# EasyEDA schematic Sheet_1.json
TITLE: Sheet_1; REV: 1.0; Date: 2022-05-22; Sheet: 1/1; Drawn By: Valdez Cruz Marco Antonio; Company: Your Company
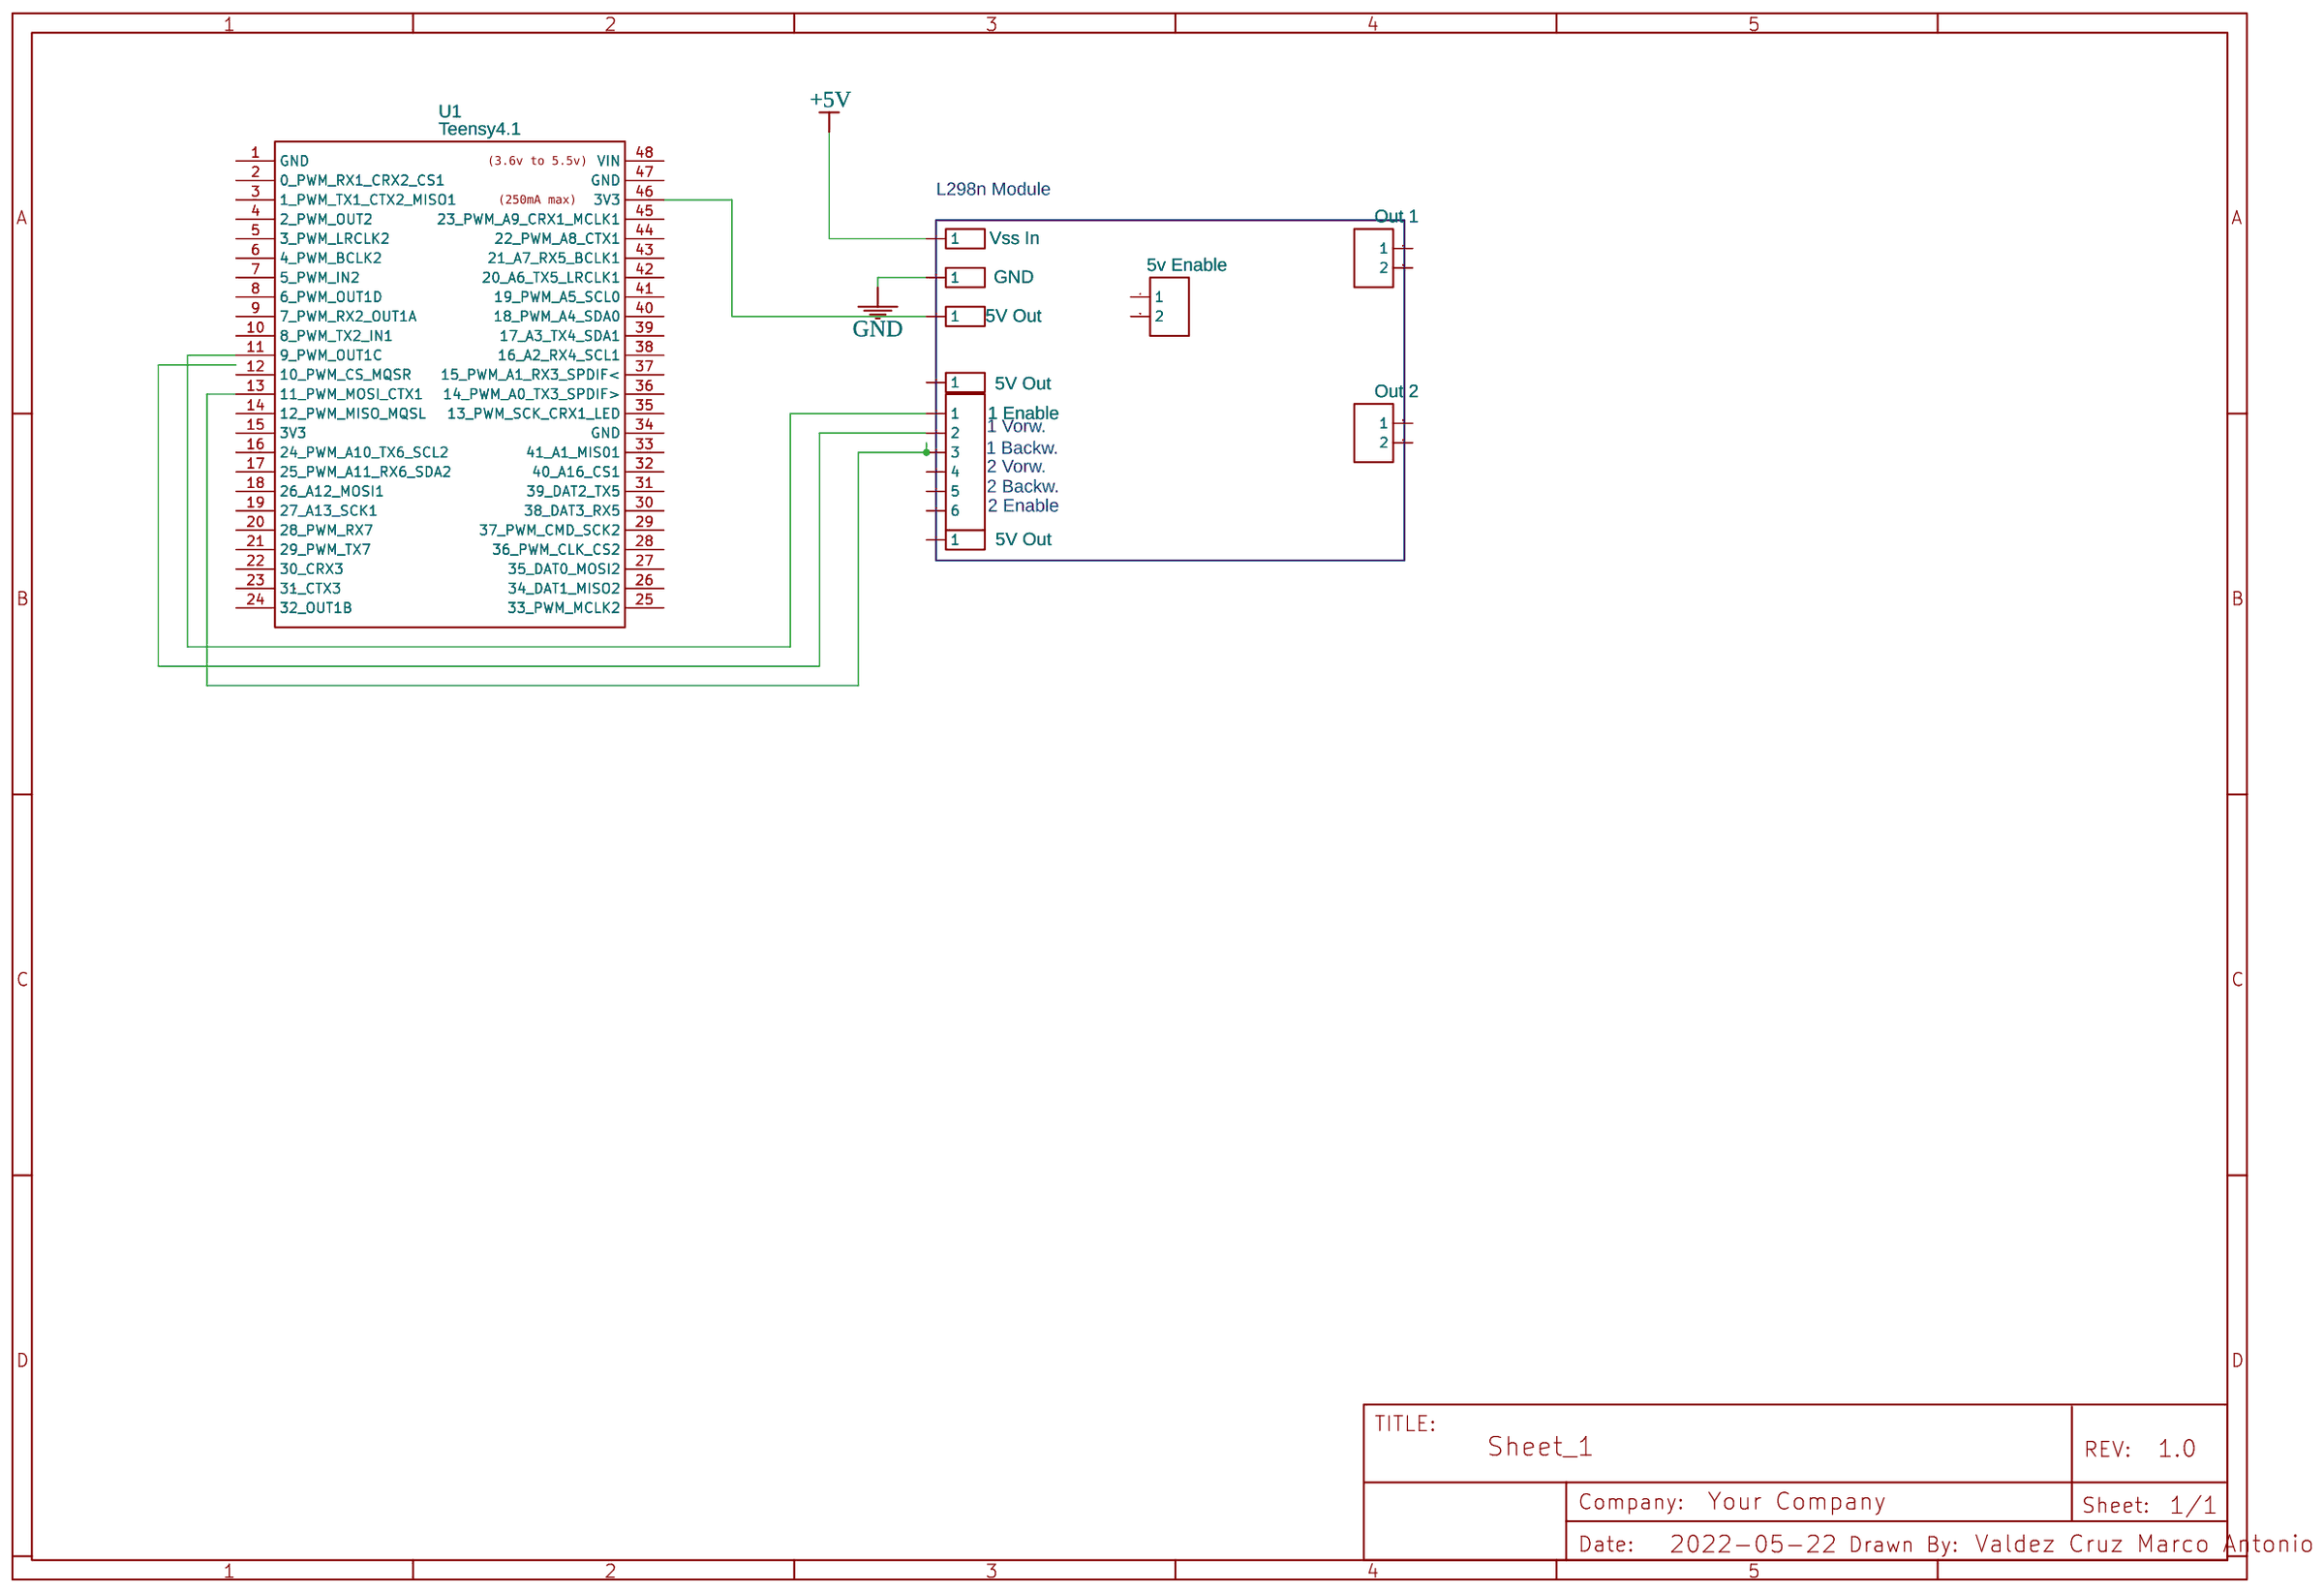
[diagram p0: schematic sheet]

## Parts
AAAAAP1  Out 1  [HDR-TH_2P-P2.54-V-M]
AAAAAP2  Out 2  [HDR-TH_2P-P2.54-V-M]
AAAAAP3  Vss In  [HDR-1X1/2.54]
AAAAAP4  GND  [HDR-1X1/2.54]
AAAAAP5  5V Out  [HDR-1X1/2.54]
AAAAAP6  5v Enable  [HDR-TH_2P-P2.54-V-M]
AAAAAP7  1 Enable  [HDR-6X1/2.54]
AAAAAP8  5V Out  [HDR-1X1/2.54]
AAAAAP9  5V Out  [HDR-1X1/2.54]
U1  Teensy4.1  [TEENSY4.1]

## Library data of the parts
AAAAAP1 AAAAAP2 AAAAAP6 = Header-Female-2.54_1x2: Supplier: LCSC; Manufacturer: BOOMELE; Manufacturer Part: 2.54-1*2PFemale; image: //image.lceda.cn/szlcsc/C49661.jpg; Supplier Part: C49661
AAAAAP3-AAAAAP5 AAAAAP8 AAAAAP9 = Header-Male-2.54_1x1: Supplier: LCSC; Manufacturer: ReliaPro; Supplier Part: C81276
AAAAAP7 = Header-Female-2.54_1x6: Supplier: LCSC; Manufacturer: BOOMELE; Manufacturer Part: Female header 1*6p; Supplier Part: C40877
U1 = Teensy4.1: Manufacturer: PJRC; link: https://www.pjrc.com/store/teensy41.html; Contributor: MaxBearMc

## Nets
+5V: AAAAAP3.1
GND: AAAAAP4.1
Net-(AAAAAP5-1): AAAAAP5.1 U1.46(3V3)
Net-(AAAAAP7-1): AAAAAP7.1 U1.11(9_PWM_OUT1C)
Net-(AAAAAP7-3): AAAAAP7.3 U1.13(11_PWM_MOSI_CTX1)

Not connected (* = marked no-connect by the designer): AAAAAP1 1 2; AAAAAP2 1 2; AAAAAP6 1 2; AAAAAP7 2 4 5 6; AAAAAP8 1; AAAAAP9 1; U1 1(GND) 2(0_PWM_RX1_CRX2_CS1) 3(1_PWM_TX1_CTX2_MISO1) 4(2_PWM_OUT2) 5(3_PWM_LRCLK2) 6(4_PWM_BCLK2) 7(5_PWM_IN2) 8(6_PWM_OUT1D) 9(7_PWM_RX2_OUT1A) 10(8_PWM_TX2_IN1) 12(10_PWM_CS_MQSR) 14(12_PWM_MISO_MQSL) 15(3V3) 16(24_PWM_A10_TX6_SCL2) 17(25_PWM_A11_RX6_SDA2) 18(26_A12_MOSI1) 19(27_A13_SCK1) 20(28_PWM_RX7) 21(29_PWM_TX7) 22(30_CRX3) 23(31_CTX3) 24(32_OUT1B) 25(33_PWM_MCLK2) 26(34_DAT1_MISO2) 27(35_DAT0_MOSI2) 28(36_PWM_CLK_CS2) 29(37_PWM_CMD_SCK2) 30(38_DAT3_RX5) 31(39_DAT2_TX5) 32(40_A16_CS1) 33(41_A1_MIS01) 34(GND) 35(13_PWM_SCK_CRX1_LED) 36(14_PWM_A0_TX3_SPDIF>) 37(15_PWM_A1_RX3_SPDIF<) 38(16_A2_RX4_SCL1) 39(17_A3_TX4_SDA1) 40(18_PWM_A4_SDA0) 41(19_PWM_A5_SCL0) 42(20_A6_TX5_LRCLK1) 43(21_A7_RX5_BCLK1) 44(22_PWM_A8_CTX1) 45(23_PWM_A9_CRX1_MCLK1) 47(GND) 48(VIN)

## Notes on the sheet
- L298n Module
- 1 Vorw.
- 1 Backw.
- 2 Backw.
- 2 Vorw.
- 2 Enable
